# Altium schematic sheet SCH_06_Filter.SchDoc
size A4; SheetNumber: 11; SheetTotal: 13; SPICEModelCacheEHPMWYPG: <root> / <DocumentId>EHPMWYPG</DocumentId> / <CacheFrame Number="0"> / <Model Name="0603_885012206095_100nf" Kind="CKT"> / <Text>******* / .subckt 0603_885012206095_100nF 1 2 / Rser 1 3 0.0157659152881 / Lser 2 4 3.10171966E-10 / C1 3 4 0.0000001 / Rpar 3 4 5000000000 / .ends 0603_885012206095_100nF</Text> / </Model> / <Model Name="0603_885012106031_10uf" Kind="CKT"> / <Text>******* / .subckt 0603_885012106031_10uF 1 2 / Rser 1 3 0.0105 / Lser 2 4 0.0000000008 / C1 3 4 0.00001 / Rpar 3 4 10000000 / .ends 0603_885012106031_10uF</Text> / </Model> / <Model Name="0603_885012106022_1uf" Kind="CKT"> / <Text>******* / .subckt 0603_885012106022_1uF 1 2 / Rser 1 3 0.00857861035867 / Lser 2 4 3.03497279E-10 / C1 3 4 0.000001 / Rpar 3 4 500000000 / .ends 0603_885012106022_1uF</Text> / </Model> / <Model Name="0603_885012206046_100nf" Kind="CKT"> / <Text>******* / .subckt 0603_885012206046_100nF 1 2 / Rser 1 3 0.0189313024822 / Lser 2 4 4.50736859E-10 / C1 3 4 0.0000001 / Rpar 3 4 5000000000 / .ends 0603_885012206046_100nF</Text> / </Model> / </CacheFrame> / </root>
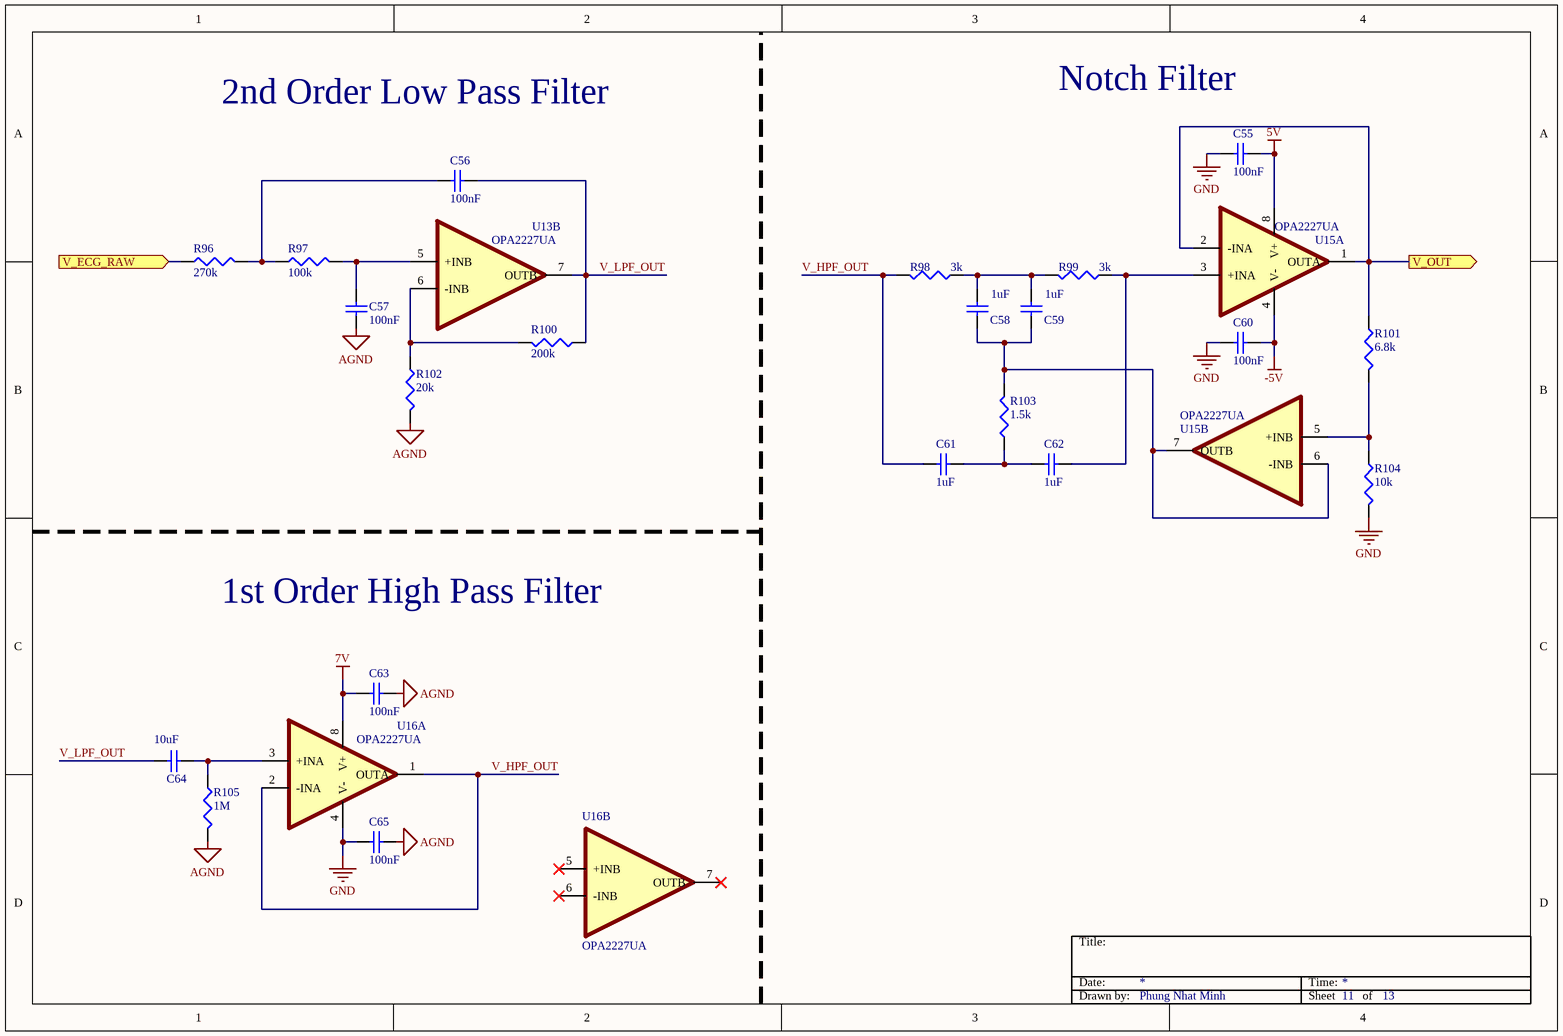
[diagram p0: SCH_06_Filter.SchDoc]

## Parts
C55  100nF  [WCAP-CSGP_0603_L1.6W0.8H0.8_Reflow]
C56  100nF  [WCAP-CSGP_0603_L1.6W0.8H0.8_Reflow]
C57  100nF  [WCAP-CSGP_0603_L1.6W0.8H0.8_Reflow]
C58  1uF  [WCAP-CSGP_0603_L1.6W0.8H0.8_Reflow]
C59  1uF  [WCAP-CSGP_0603_L1.6W0.8H0.8_Reflow]
C60  100nF  [WCAP-CSGP_0603_L1.6W0.8H0.8_Reflow]
C61  1uF  [WCAP-CSGP_0603_L1.6W0.8H0.8_Reflow]
C62  1uF  [WCAP-CSGP_0603_L1.6W0.8H0.8_Reflow]
C63  100nF  [WCAP-CSGP_0603_L1.6W0.8H0.8_Reflow]
C64  10uF  [WCAP-CSGP_0603_L1.6W0.8H0.8_Reflow]
C65  100nF  [WCAP-CSGP_0603_L1.6W0.8H0.8_Reflow]
R96  270k  [WRIS-PSMB_0603_L1.6W0.8H0.35]
R97  100k  [WRIS-PSMB_0603_L1.6W0.8H0.35]
R98  3k  [WRIS-PSMB_0603_L1.6W0.8H0.35]
R99  3k  [WRIS-PSMB_0603_L1.6W0.8H0.35]
R100  200k  [WRIS-PSMB_0603_L1.6W0.8H0.35]
R101  6.8k  [WRIS-PSMB_0603_L1.6W0.8H0.35]
R102  20k  [WRIS-PSMB_0603_L1.6W0.8H0.35]
R103  1.5k  [WRIS-PSMB_0603_L1.6W0.8H0.35]
R104  10k  [WRIS-PSMB_0603_L1.6W0.8H0.35]
R105  1M  [WRIS-PSMB_0603_L1.6W0.8H0.35]
U13  OPA2227UA  [SOIC127P599X175-8N]  (part B of 2)
U15  OPA2227UA  [SOIC127P599X175-8N]  (parts A,B of 2)
U16  OPA2227UA  [SOIC127P599X175-8N]  (parts A,B of 2)

## Ports
V_ECG_RAW (in, see Schematic_Top[3B], SCH_05_Analog_Mux[4B]), V_OUT (out, see Schematic_Top[3B], SCH_07_ADC[2B])

## Nets
5V: C55.2 U15.8(V+)
7V: C63.2 U16.8(V+)
-5V: C60.2 U15.4(V-)
AGND: C57.1 C63.1 C65.1 R102.2 R105.2
GND: C55.1 C60.1 C65.2 R104.2 U16.4(V-)
V_ECG_RAW: R96.1 ; port V_ECG_RAW
V_HPF_OUT: C61.2 R98.2 U16.1(OUTA) U16.2(-INA)
V_LPF_OUT: C56.1 C64.1 R100.1 U13.7(OUTB)
V_OUT: R101.1 U15.1(OUTA) U15.2(-INA) ; port V_OUT
NetC56_2: C56.2 R96.2 R97.1
NetC57_2: C57.2 R97.2 U13.5(+INB)
NetC58_1: C58.1 C59.1 R103.2 U15.6(-INB) U15.7(OUTB)
NetC58_2: C58.2 C59.2 R98.1 R99.2
NetC61_1: C61.1 C62.2 R103.1
NetC62_1: C62.1 R99.1 U15.3(+INA)
NetC64_2: C64.2 R105.1 U16.3(+INA)
NetR100_2: R100.2 R102.1 U13.6(-INB)
NetR101_2: R101.2 R104.1 U15.5(+INB)

Not connected (* = marked no-connect by the designer): U16 5(+INB)* 6(-INB)* 7(OUTB)*

## Notes on the sheet
- 2nd Order Low Pass Filter
- Notch Filter
- 1st Order High Pass Filter
- Title:
- Date:
- Time:
- Drawn by:
- Phung Nhat Minh
- Sheet
- of

## Library data of the parts
C55 C60 = 885012206046: WCAP-CSGP Multilayer Ceramic Chip Capacitor, General Purpose, size 0603, X7R, 100nF, 16VDC; Manufacturer: Wurth Elektronik; Case/Size Code: 0603; Capacitance Tolerance: +/-10%; Dissipation Factor: 3.5%; Insulation Resistance: 5GOhm; Rated Voltage (DC): 16V; Technical Reference: X7R0603104K016DFCT10000; Manufacturer Part Number: 885012206046; Category: Multilayer Ceramic Chip Capacitors; Match Code: WCAP-CSGP; ComponentLink1Description: Website Link; ComponentLink1URL: https://www.we-online.com/redexpert/article/885012206046?ad; ComponentLink2Description: Datasheet Link; ComponentLink2URL: https://www.we-online.com/redexpert/spec/885012206046?ad; Mount: Surface Mount; Operating Temperature Max: 125°C; Operating Temperature Min: -55°C; Packaging: Tape and Reel; Length: 1.6mm; Width: 0.8mm; Height: 0.8mm; Capacitance: 100nF; Ceramic Type: X7R
C56 C57 C63 C65 = 885012206095: WCAP-CSGP Multilayer Ceramic Chip Capacitor, General Purpose, size 0603, X7R, 100nF, 50VDC; Manufacturer: Wurth Elektronik; Case/Size Code: 0603; Capacitance Tolerance: +/-10%; Dissipation Factor: 3%; Insulation Resistance: 5GOhm; Rated Voltage (DC): 50V; Technical Reference: X7R0603104K050DFCT10000; Manufacturer Part Number: 885012206095; Category: Multilayer Ceramic Chip Capacitors; Match Code: WCAP-CSGP; ComponentLink1Description: Website Link; ComponentLink1URL: https://www.we-online.com/redexpert/article/885012206095?ad; ComponentLink2Description: Datasheet Link; ComponentLink2URL: https://www.we-online.com/redexpert/spec/885012206095?ad; Mount: Surface Mount; Operating Temperature Max: 125°C; Operating Temperature Min: -55°C; Packaging: Tape and Reel; Length: 1.6mm; Width: 0.8mm; Height: 0.8mm; Capacitance: 100nF; Ceramic Type: X7R
C58 C59 C61 C62 = 885012106022: WCAP-CSGP Multilayer Ceramic Chip Capacitor, General Purpose, size 0603, X5R, 1uF, 25VDC; Manufacturer: Wurth Elektronik; Case/Size Code: 0603; Capacitance Tolerance: +/-20%; Dissipation Factor: 10%; Insulation Resistance: 0.5GOhm; Rated Voltage (DC): 25V; Technical Reference: X5R0603105M025DFCT10000; Manufacturer Part Number: 885012106022; Category: Multilayer Ceramic Chip Capacitors; Match Code: WCAP-CSGP; ComponentLink1Description: Website Link; ComponentLink1URL: https://www.we-online.com/redexpert/article/885012106022?ad; ComponentLink2Description: Datasheet Link; ComponentLink2URL: https://www.we-online.com/redexpert/spec/885012106022?ad; Mount: Surface Mount; Operating Temperature Max: 85°C; Operating Temperature Min: -55°C; Packaging: Tape and Reel; Length: 1.6mm; Width: 0.8mm; Height: 0.8mm; Capacitance: 1uF; Ceramic Type: X5R
C64 = 885012106031: WCAP-CSGP Multilayer Ceramic Chip Capacitor, General Purpose, size 0603, X5R, 10uF, 25VDC; Manufacturer: Wurth Elektronik; Case/Size Code: 0603; Capacitance Tolerance: +/20%; Dissipation Factor: 20%; Insulation Resistance: 0.01GOhm; Rated Voltage (DC): 25V; Technical Reference: X5R0603106M025DFCT10000; Manufacturer Part Number: 885012106031; Category: Multilayer Ceramic Chip Capacitors; Match Code: WCAP-CSGP; ComponentLink1Description: Website Link; ComponentLink1URL: https://www.we-online.com/redexpert/article/885012106031?ad; ComponentLink2Description: Datasheet Link; ComponentLink2URL: https://www.we-online.com/redexpert/spec/885012106031?ad; Mount: Surface Mount; Operating Temperature Max: 85°C; Operating Temperature Min: -55°C; Packaging: Tape and Reel; Length: 1.6mm; Width: 0.8mm; Height: 0.8mm; Capacitance: 10uF; Ceramic Type: X5R
R96-R105 = 580060716001: WRIS-PSMB Metal Plate Resistor, SMT, size 0603, 0.33W, 5mΩ, +/-1%; Manufacturer: Wurth Elektronik; Case/Size Code: 0603; Rated Current: 8.12A; Technical Reference: MB0603R005F103KAATP0000; Temperature Coefficient of Resistance: +/-100ppm/°C; Manufacturer Part Number: 580060716001; Category: Metal Plate Resistors; Match Code: WRIS-PSMB; ComponentLink1Description: Website Link; ComponentLink1URL: https://www.we-online.com/redexpert/article/580060716001?ad; ComponentLink2Description: Datasheet Link; ComponentLink2URL: https://www.we-online.com/redexpert/spec/580060716001?ad; Mount: Surface Mount; Operating Temperature Max: 155°C; Operating Temperature Min: -55°C; Packaging: Tape and Reel; Length: 1.6mm; Width: 0.8mm; Height: 0.35mm; Rated Power: 0.33W; Resistance: 5mΩ; Resistance Tolerance: +/-1%
U13 U15 U16 = OPA2227UA: Package: None; Price: None; Value: *; MP: OPA2227UA; Availability: Unavailable